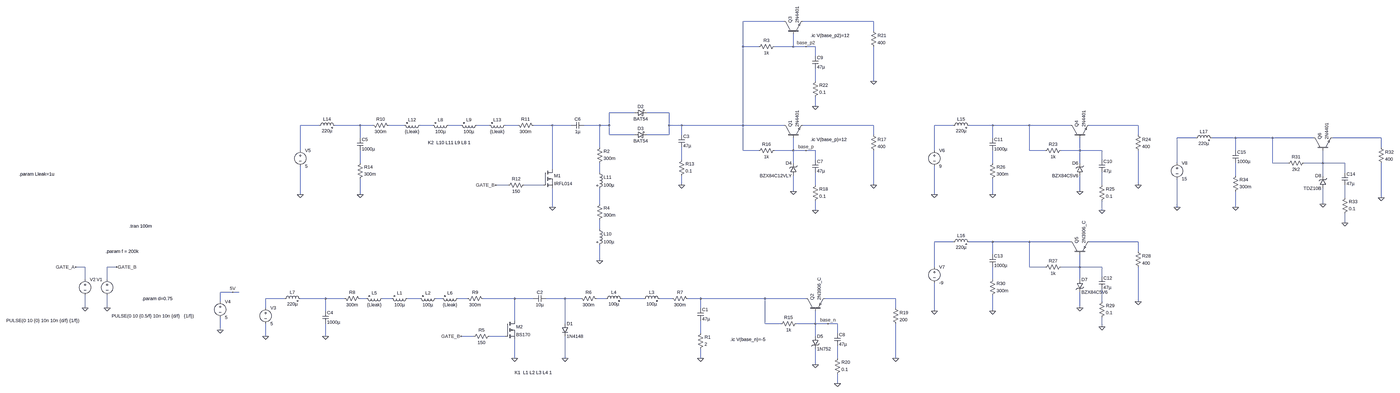
[diagram p0: schematic 101_power_supply.asc, whole sheet]
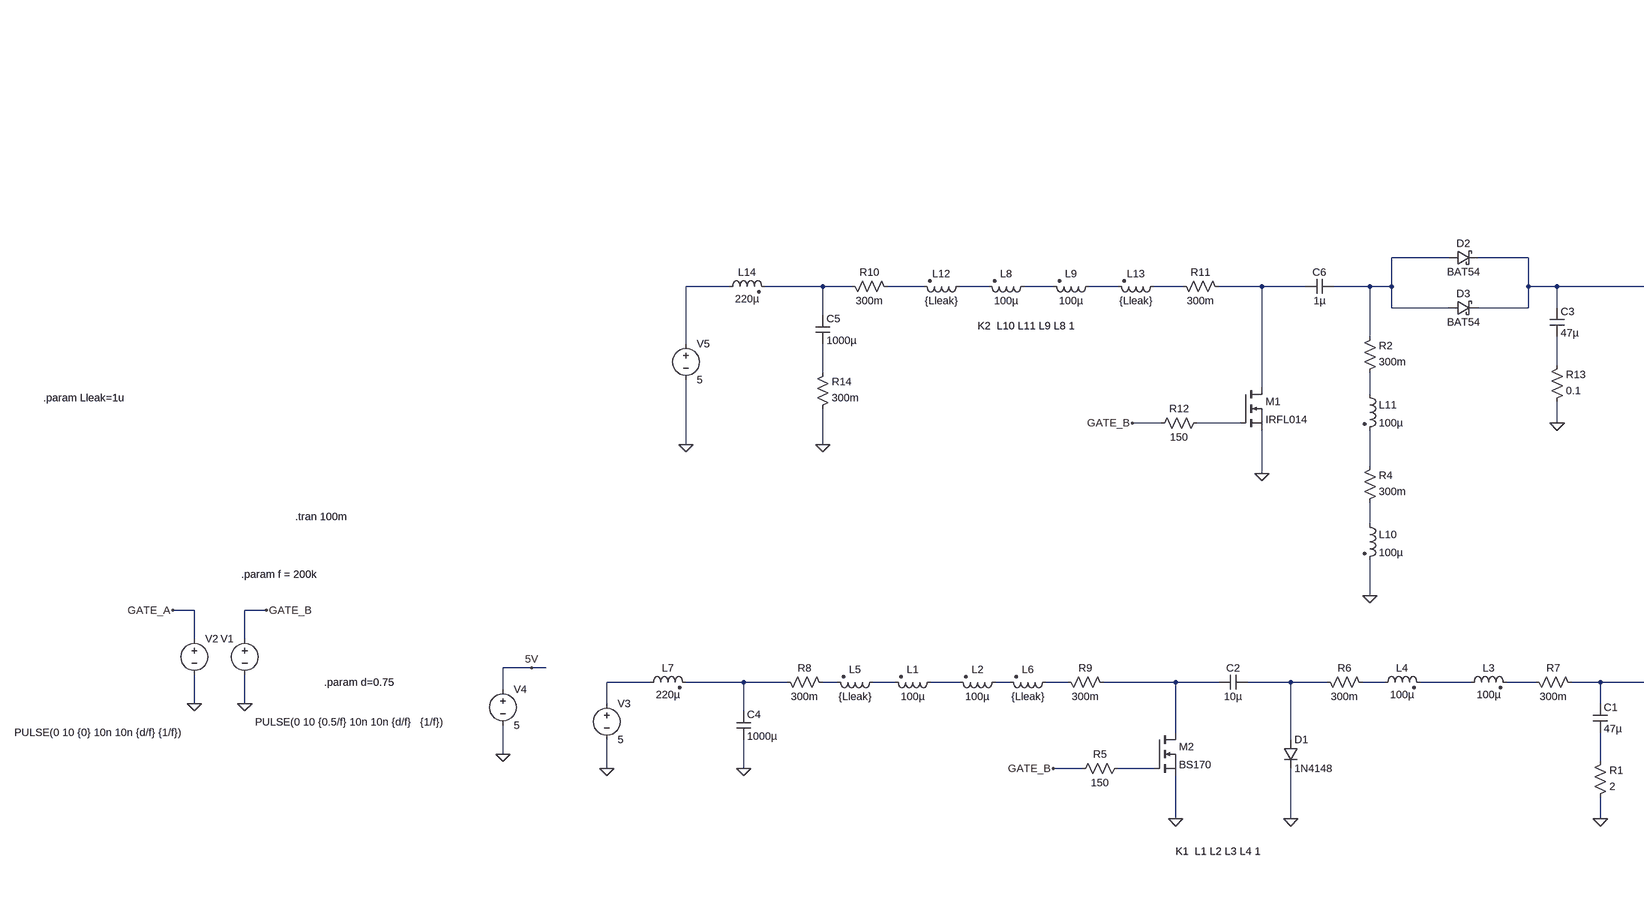
[diagram p1: schematic 101_power_supply.asc, part, row 1 of 1, column 1 of 2]
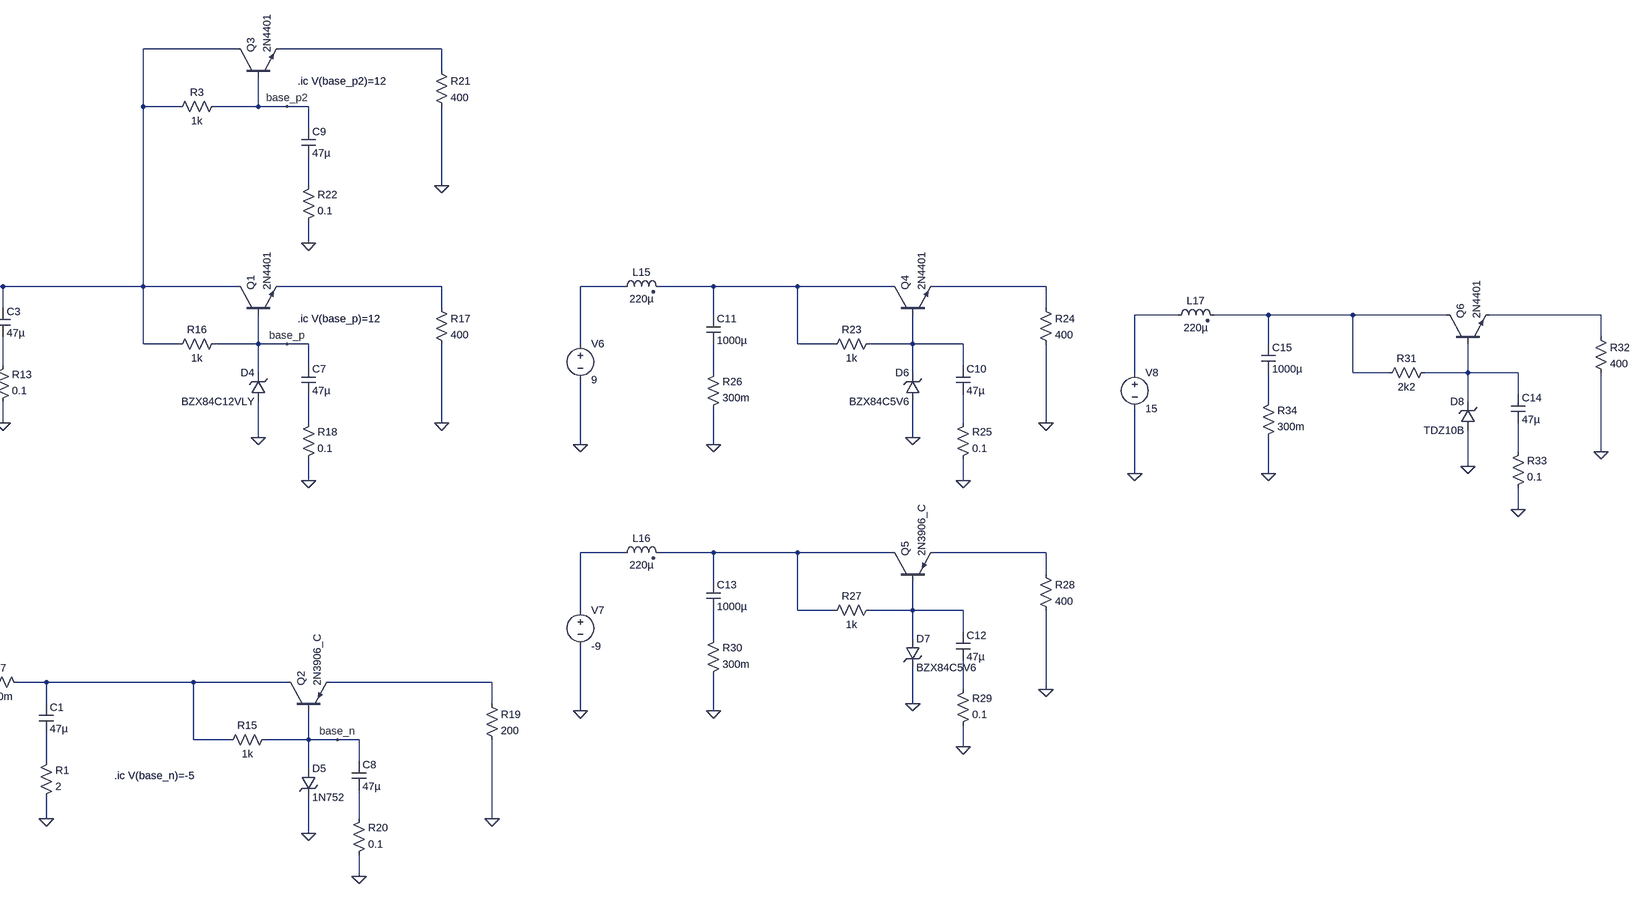
[diagram p2: schematic 101_power_supply.asc, part, row 1 of 1, column 2 of 2]
101_power_supply.asc, the LTspice schematic file:
Version 4
SHEET 1 4996 680
WIRE 1504 -1648 1296 -1648
WIRE 1968 -1648 1600 -1648
WIRE 1968 -1600 1968 -1648
WIRE 1296 -1520 1296 -1648
WIRE 1376 -1520 1296 -1520
WIRE 1552 -1520 1552 -1584
WIRE 1552 -1520 1456 -1520
WIRE 1616 -1520 1552 -1520
WIRE 1664 -1520 1616 -1520
WIRE 1664 -1472 1664 -1520
WIRE 1664 -1344 1664 -1408
WIRE 1968 -1344 1968 -1520
WIRE 1664 -1216 1664 -1264
WIRE 640 -1184 512 -1184
WIRE 816 -1184 704 -1184
WIRE -960 -1120 -1056 -1120
WIRE -752 -1120 -880 -1120
WIRE -688 -1120 -752 -1120
WIRE -528 -1120 -608 -1120
WIRE -384 -1120 -448 -1120
WIRE -240 -1120 -304 -1120
WIRE -96 -1120 -160 -1120
WIRE 48 -1120 -16 -1120
WIRE 224 -1120 128 -1120
WIRE 320 -1120 224 -1120
WIRE 464 -1120 384 -1120
WIRE 512 -1120 512 -1184
WIRE 512 -1120 464 -1120
WIRE 816 -1120 816 -1184
WIRE 880 -1120 816 -1120
WIRE 1296 -1120 1296 -1520
WIRE 1296 -1120 880 -1120
WIRE 1504 -1120 1296 -1120
WIRE 1968 -1120 1600 -1120
WIRE 2464 -1120 2368 -1120
WIRE 2672 -1120 2544 -1120
WIRE 2864 -1120 2672 -1120
WIRE 3072 -1120 2864 -1120
WIRE 3536 -1120 3168 -1120
WIRE 512 -1072 512 -1120
WIRE 640 -1072 512 -1072
WIRE 816 -1072 816 -1120
WIRE 816 -1072 704 -1072
WIRE 880 -1072 880 -1120
WIRE 1968 -1072 1968 -1120
WIRE 3536 -1072 3536 -1120
WIRE -752 -1056 -752 -1120
WIRE 2672 -1056 2672 -1120
WIRE 3856 -1056 3760 -1056
WIRE 4064 -1056 3936 -1056
WIRE 4256 -1056 4064 -1056
WIRE 4464 -1056 4256 -1056
WIRE 4928 -1056 4560 -1056
WIRE 464 -1008 464 -1120
WIRE 4928 -1008 4928 -1056
WIRE -1056 -992 -1056 -1120
WIRE 1296 -992 1296 -1120
WIRE 1376 -992 1296 -992
WIRE 1552 -992 1552 -1056
WIRE 1552 -992 1456 -992
WIRE 1616 -992 1552 -992
WIRE 1664 -992 1616 -992
WIRE 2368 -992 2368 -1120
WIRE 2864 -992 2864 -1120
WIRE 2944 -992 2864 -992
WIRE 3120 -992 3120 -1056
WIRE 3120 -992 3024 -992
WIRE 3232 -992 3120 -992
WIRE 4064 -992 4064 -1056
WIRE 880 -944 880 -1008
WIRE 1664 -944 1664 -992
WIRE 3232 -944 3232 -992
WIRE -752 -928 -752 -992
WIRE 1552 -928 1552 -992
WIRE 2672 -928 2672 -992
WIRE 3120 -928 3120 -992
WIRE 3760 -928 3760 -1056
WIRE 4256 -928 4256 -1056
WIRE 4336 -928 4256 -928
WIRE 4512 -928 4512 -992
WIRE 4512 -928 4416 -928
WIRE 4624 -928 4512 -928
WIRE 224 -896 224 -1120
WIRE 464 -880 464 -928
WIRE 4624 -880 4624 -928
WIRE 4064 -864 4064 -928
WIRE 4512 -864 4512 -928
WIRE 0 -816 -64 -816
WIRE 176 -816 80 -816
WIRE 880 -816 880 -864
WIRE 1664 -816 1664 -880
WIRE 1968 -816 1968 -992
WIRE 3232 -816 3232 -880
WIRE 3536 -816 3536 -992
WIRE 1552 -784 1552 -864
WIRE 3120 -784 3120 -864
WIRE -1056 -768 -1056 -912
WIRE -752 -768 -752 -848
WIRE 2368 -768 2368 -912
WIRE 2672 -768 2672 -848
WIRE 4624 -752 4624 -816
WIRE 4928 -752 4928 -928
WIRE 464 -720 464 -800
WIRE 4512 -720 4512 -800
WIRE 224 -704 224 -800
WIRE 3760 -704 3760 -848
WIRE 4064 -704 4064 -784
WIRE 1664 -688 1664 -736
WIRE 3232 -688 3232 -736
WIRE 4624 -624 4624 -672
WIRE 464 -592 464 -640
WIRE 2464 -528 2368 -528
WIRE 2672 -528 2544 -528
WIRE 2864 -528 2672 -528
WIRE 3072 -528 2864 -528
WIRE 3536 -528 3168 -528
WIRE 3536 -480 3536 -528
WIRE 2672 -464 2672 -528
WIRE 464 -432 464 -512
WIRE -2672 -400 -2720 -400
WIRE -2512 -400 -2560 -400
WIRE 2368 -400 2368 -528
WIRE 2864 -400 2864 -528
WIRE 2944 -400 2864 -400
WIRE 3120 -400 3120 -464
WIRE 3120 -400 3024 -400
WIRE 3232 -400 3120 -400
WIRE 3232 -352 3232 -400
WIRE -2672 -336 -2672 -400
WIRE -2560 -336 -2560 -400
WIRE 2672 -336 2672 -400
WIRE 3120 -336 3120 -400
WIRE -1424 -272 -1488 -272
WIRE -1392 -272 -1424 -272
WIRE -1136 -240 -1232 -240
WIRE -928 -240 -1056 -240
WIRE -832 -240 -928 -240
WIRE -720 -240 -752 -240
WIRE -592 -240 -640 -240
WIRE -448 -240 -512 -240
WIRE -336 -240 -368 -240
WIRE -208 -240 -256 -240
WIRE 32 -240 -128 -240
WIRE 128 -240 32 -240
WIRE 288 -240 192 -240
WIRE 368 -240 288 -240
WIRE 496 -240 448 -240
WIRE 688 -240 576 -240
WIRE 832 -240 768 -240
WIRE 976 -240 912 -240
WIRE 1408 -240 976 -240
WIRE 1616 -240 1408 -240
WIRE 2080 -240 1712 -240
WIRE -1488 -224 -1488 -272
WIRE 3232 -224 3232 -288
WIRE 3536 -224 3536 -400
WIRE -2672 -192 -2672 -256
WIRE -2560 -192 -2560 -256
WIRE -1232 -192 -1232 -240
WIRE 976 -192 976 -240
WIRE 2080 -192 2080 -240
WIRE 3120 -192 3120 -272
WIRE -928 -176 -928 -240
WIRE 2368 -176 2368 -320
WIRE 2672 -176 2672 -256
WIRE 32 -128 32 -240
WIRE 288 -112 288 -240
WIRE 1408 -112 1408 -240
WIRE 1488 -112 1408 -112
WIRE 1664 -112 1664 -176
WIRE 1664 -112 1568 -112
WIRE 1728 -112 1664 -112
WIRE 1776 -112 1728 -112
WIRE 3232 -96 3232 -144
WIRE -1488 -80 -1488 -144
WIRE 976 -64 976 -128
WIRE 1776 -64 1776 -112
WIRE -1232 -48 -1232 -112
WIRE -928 -48 -928 -112
WIRE -176 -48 -240 -48
WIRE -16 -48 -96 -48
WIRE 1664 -48 1664 -112
WIRE 32 64 32 -32
WIRE 288 64 288 -48
WIRE 976 64 976 16
WIRE 1776 64 1776 0
WIRE 2080 64 2080 -112
WIRE 1664 96 1664 16
WIRE 1776 192 1776 144
FLAG -2560 -192 0
FLAG -2512 -400 GATE_B
FLAG -2720 -400 GATE_A
FLAG -1232 -48 0
FLAG -2672 -192 0
FLAG -240 -48 GATE_B
FLAG 32 64 0
FLAG -928 -48 0
FLAG 288 64 0
FLAG 976 64 0
FLAG -1488 -80 0
FLAG -1424 -272 5V
FLAG -1056 -768 0
FLAG -64 -816 GATE_B
FLAG 224 -704 0
FLAG -752 -768 0
FLAG 880 -816 0
FLAG 464 -432 0
FLAG 1552 -784 0
FLAG 1968 -816 0
FLAG 1664 -688 0
FLAG 1616 -992 base_p
FLAG 1664 96 0
FLAG 2080 64 0
FLAG 1776 192 0
FLAG 1728 -112 base_n
FLAG 1968 -1344 0
FLAG 1664 -1216 0
FLAG 1616 -1520 base_p2
FLAG 3120 -784 0
FLAG 3536 -816 0
FLAG 3232 -688 0
FLAG 2368 -768 0
FLAG 2672 -768 0
FLAG 3120 -192 0
FLAG 3536 -224 0
FLAG 3232 -96 0
FLAG 2368 -176 0
FLAG 2672 -176 0
FLAG 4512 -720 0
FLAG 4928 -752 0
FLAG 4624 -624 0
FLAG 3760 -704 0
FLAG 4064 -704 0
SYMBOL voltage -2560 -352 M0
WINDOW 123 0 0 Left 0
WINDOW 39 0 0 Left 0
WINDOW 3 -444 201 Left 2
SYMATTR Value PULSE(0 10 {0.5/f} 10n 10n {d/f}   {1/f})
SYMATTR InstName V1
SYMBOL voltage -2672 -352 R0
WINDOW 123 0 0 Left 0
WINDOW 39 0 0 Left 0
WINDOW 3 -400 224 Left 2
SYMATTR Value PULSE(0 10 {0} 10n 10n {d/f} {1/f})
SYMATTR InstName V2
SYMBOL voltage -1232 -208 R0
WINDOW 123 0 0 Left 0
WINDOW 39 0 0 Left 0
SYMATTR InstName V3
SYMATTR Value 5
SYMBOL cap 960 -192 R0
SYMATTR InstName C1
SYMATTR Value 47µ
SYMBOL ind2 -496 -256 R90
WINDOW 0 4 56 VBottom 2
WINDOW 3 32 56 VTop 2
SYMATTR InstName L1
SYMATTR Value 100µ
SYMATTR Type ind
SYMATTR SpiceLine Rser=0.2
SYMBOL ind2 -352 -256 R90
WINDOW 0 4 56 VBottom 2
WINDOW 3 32 56 VTop 2
SYMATTR InstName L2
SYMATTR Value 100µ
SYMATTR Type ind
SYMATTR SpiceLine Rser=0.2
SYMBOL ind2 672 -224 R270
WINDOW 0 32 56 VTop 2
WINDOW 3 4 56 VBottom 2
SYMATTR InstName L3
SYMATTR Value 100µ
SYMATTR Type ind
SYMATTR SpiceLine Rser=0.4
SYMBOL ind2 480 -224 R270
WINDOW 0 32 56 VTop 2
WINDOW 3 4 56 VBottom 2
SYMATTR InstName L4
SYMATTR Value 100µ
SYMATTR Type ind
SYMATTR SpiceLine Rser=0.4
SYMBOL res 464 -224 M270
WINDOW 0 32 56 VTop 2
WINDOW 3 0 56 VBottom 2
SYMATTR InstName R6
SYMATTR Value 300m
SYMBOL res 928 -224 M270
WINDOW 0 32 56 VTop 2
WINDOW 3 0 56 VBottom 2
SYMATTR InstName R7
SYMATTR Value 300m
SYMBOL res -848 -256 M90
WINDOW 0 0 56 VBottom 2
WINDOW 3 32 56 VTop 2
SYMATTR InstName R8
SYMATTR Value 300m
SYMBOL res -224 -256 M90
WINDOW 0 0 56 VBottom 2
WINDOW 3 32 56 VTop 2
SYMATTR InstName R9
SYMATTR Value 300m
SYMBOL res -80 -64 R90
WINDOW 0 0 56 VBottom 2
WINDOW 3 32 56 VTop 2
SYMATTR InstName R5
SYMATTR Value 150
SYMBOL nmos -16 -128 R0
SYMATTR InstName M2
SYMATTR Value BS170
SYMBOL ind2 -624 -256 R90
WINDOW 0 4 56 VBottom 2
WINDOW 3 32 56 VTop 2
SYMATTR InstName L5
SYMATTR Value {Lleak}
SYMATTR Type ind
SYMATTR SpiceLine Rser=0.2
SYMBOL ind2 -240 -256 R90
WINDOW 0 4 56 VBottom 2
WINDOW 3 32 56 VTop 2
SYMATTR InstName L6
SYMATTR Value {Lleak}
SYMATTR Type ind
SYMATTR SpiceLine Rser=0.2
SYMBOL ind2 -1152 -224 R270
WINDOW 0 32 56 VTop 2
WINDOW 3 4 56 VBottom 2
SYMATTR InstName L7
SYMATTR Value 220µ
SYMATTR Type ind
SYMATTR SpiceLine Rser=0.2
SYMBOL cap -944 -176 R0
SYMATTR InstName C4
SYMATTR Value 1000µ
SYMBOL cap 192 -256 R90
WINDOW 0 0 32 VBottom 2
WINDOW 3 32 32 VTop 2
SYMATTR InstName C2
SYMATTR Value 10µ
SYMBOL diode 272 -112 R0
SYMATTR InstName D1
SYMATTR Value 1N4148
SYMBOL res 960 32 M180
WINDOW 0 36 76 Left 2
WINDOW 3 36 40 Left 2
SYMATTR InstName R1
SYMATTR Value 2
SYMBOL voltage -1488 -240 R0
WINDOW 123 0 0 Left 0
WINDOW 39 0 0 Left 0
SYMATTR InstName V4
SYMATTR Value 5
SYMBOL voltage -1056 -1008 R0
WINDOW 123 0 0 Left 0
WINDOW 39 0 0 Left 0
SYMATTR InstName V5
SYMATTR Value 5
SYMBOL cap 864 -1072 R0
SYMATTR InstName C3
SYMATTR Value 47µ
SYMBOL ind2 -288 -1136 R90
WINDOW 0 4 56 VBottom 2
WINDOW 3 32 56 VTop 2
SYMATTR InstName L8
SYMATTR Value 100µ
SYMATTR Type ind
SYMATTR SpiceLine Rser=0.2
SYMBOL ind2 -144 -1136 R90
WINDOW 0 4 56 VBottom 2
WINDOW 3 32 56 VTop 2
SYMATTR InstName L9
SYMATTR Value 100µ
SYMATTR Type ind
SYMATTR SpiceLine Rser=0.2
SYMBOL ind2 448 -608 R0
SYMATTR InstName L10
SYMATTR Value 100µ
SYMATTR Type ind
SYMATTR SpiceLine Rser=0.4
SYMBOL ind2 448 -896 R0
SYMATTR InstName L11
SYMATTR Value 100µ
SYMATTR Type ind
SYMATTR SpiceLine Rser=0.4
SYMBOL res 448 -912 M180
WINDOW 0 36 76 Left 2
WINDOW 3 36 40 Left 2
SYMATTR InstName R2
SYMATTR Value 300m
SYMBOL res 448 -624 M180
WINDOW 0 36 76 Left 2
WINDOW 3 36 40 Left 2
SYMATTR InstName R4
SYMATTR Value 300m
SYMBOL res -704 -1136 M90
WINDOW 0 0 56 VBottom 2
WINDOW 3 32 56 VTop 2
SYMATTR InstName R10
SYMATTR Value 300m
SYMBOL res 32 -1136 M90
WINDOW 0 0 56 VBottom 2
WINDOW 3 32 56 VTop 2
SYMATTR InstName R11
SYMATTR Value 300m
SYMBOL res 96 -832 R90
WINDOW 0 0 56 VBottom 2
WINDOW 3 32 56 VTop 2
SYMATTR InstName R12
SYMATTR Value 150
SYMBOL ind2 -432 -1136 R90
WINDOW 0 4 56 VBottom 2
WINDOW 3 32 56 VTop 2
SYMATTR InstName L12
SYMATTR Value {Lleak}
SYMATTR Type ind
SYMATTR SpiceLine Rser=0.2
SYMBOL ind2 0 -1136 R90
WINDOW 0 4 56 VBottom 2
WINDOW 3 32 56 VTop 2
SYMATTR InstName L13
SYMATTR Value {Lleak}
SYMATTR Type ind
SYMATTR SpiceLine Rser=0.2
SYMBOL ind2 -976 -1104 R270
WINDOW 0 32 56 VTop 2
WINDOW 3 4 56 VBottom 2
SYMATTR InstName L14
SYMATTR Value 220µ
SYMATTR Type ind
SYMATTR SpiceLine Rser=0.2
SYMBOL cap -768 -1056 R0
SYMATTR InstName C5
SYMATTR Value 1000µ
SYMBOL cap 384 -1136 R90
WINDOW 0 0 32 VBottom 2
WINDOW 3 32 32 VTop 2
SYMATTR InstName C6
SYMATTR Value 1µ
SYMBOL schottky 640 -1168 R270
WINDOW 0 32 32 VTop 2
WINDOW 3 0 32 VBottom 2
SYMATTR InstName D2
SYMATTR Value BAT54
SYMATTR Description Diode
SYMATTR Type diode
SYMBOL res 864 -848 M180
WINDOW 0 36 76 Left 2
WINDOW 3 36 40 Left 2
SYMATTR InstName R13
SYMATTR Value 0.1
SYMBOL nmos 176 -896 R0
SYMATTR InstName M1
SYMATTR Value IRFL014
SYMBOL schottky 640 -1056 R270
WINDOW 0 32 32 VTop 2
WINDOW 3 0 32 VBottom 2
SYMATTR InstName D3
SYMATTR Value BAT54
SYMATTR Description Diode
SYMATTR Type diode
SYMBOL res -768 -832 M180
WINDOW 0 36 76 Left 2
WINDOW 3 36 40 Left 2
SYMATTR InstName R14
SYMATTR Value 300m
SYMBOL npn 1504 -1056 R270
SYMATTR InstName Q1
SYMATTR Value 2N4401
SYMBOL res 1472 -1008 R90
WINDOW 0 0 56 VBottom 2
WINDOW 3 32 56 VTop 2
SYMATTR InstName R16
SYMATTR Value 1k
SYMBOL zener 1568 -864 R180
WINDOW 0 24 64 Left 2
WINDOW 3 24 0 Left 2
SYMATTR InstName D4
SYMATTR Value BZX84C12VLY
SYMATTR Description Diode
SYMATTR Type diode
SYMBOL res 1952 -1088 R0
SYMATTR InstName R17
SYMATTR Value 400
SYMBOL cap 1648 -944 R0
SYMATTR InstName C7
SYMATTR Value 47µ
SYMBOL res 1648 -720 M180
WINDOW 0 36 76 Left 2
WINDOW 3 36 40 Left 2
SYMATTR InstName R18
SYMATTR Value 0.1
SYMBOL res 1584 -128 R90
WINDOW 0 0 56 VBottom 2
WINDOW 3 32 56 VTop 2
SYMATTR InstName R15
SYMATTR Value 1k
SYMBOL zener 1648 -48 R0
SYMATTR InstName D5
SYMATTR Value 1N752
SYMATTR Description Diode
SYMATTR Type diode
SYMBOL res 2064 -208 R0
SYMATTR InstName R19
SYMATTR Value 200
SYMBOL cap 1760 -64 R0
SYMATTR InstName C8
SYMATTR Value 47µ
SYMBOL res 1760 160 M180
WINDOW 0 36 76 Left 2
WINDOW 3 36 40 Left 2
SYMATTR InstName R20
SYMATTR Value 0.1
SYMBOL pnp 1616 -176 R270
SYMATTR InstName Q2
SYMATTR Value 2N3906_C
SYMBOL npn 1504 -1584 R270
SYMATTR InstName Q3
SYMATTR Value 2N4401
SYMBOL res 1472 -1536 R90
WINDOW 0 0 56 VBottom 2
WINDOW 3 32 56 VTop 2
SYMATTR InstName R3
SYMATTR Value 1k
SYMBOL res 1952 -1616 R0
SYMATTR InstName R21
SYMATTR Value 400
SYMBOL cap 1648 -1472 R0
SYMATTR InstName C9
SYMATTR Value 47µ
SYMBOL res 1648 -1248 M180
WINDOW 0 36 76 Left 2
WINDOW 3 36 40 Left 2
SYMATTR InstName R22
SYMATTR Value 0.1
SYMBOL npn 3072 -1056 R270
SYMATTR InstName Q4
SYMATTR Value 2N4401
SYMBOL res 3040 -1008 R90
WINDOW 0 0 56 VBottom 2
WINDOW 3 32 56 VTop 2
SYMATTR InstName R23
SYMATTR Value 1k
SYMBOL zener 3136 -864 R180
WINDOW 0 24 64 Left 2
WINDOW 3 24 0 Left 2
SYMATTR InstName D6
SYMATTR Value BZX84C5V6
SYMATTR Description Diode
SYMATTR Type diode
SYMBOL res 3520 -1088 R0
SYMATTR InstName R24
SYMATTR Value 400
SYMBOL cap 3216 -944 R0
SYMATTR InstName C10
SYMATTR Value 47µ
SYMBOL res 3216 -720 M180
WINDOW 0 36 76 Left 2
WINDOW 3 36 40 Left 2
SYMATTR InstName R25
SYMATTR Value 0.1
SYMBOL voltage 2368 -1008 R0
WINDOW 123 0 0 Left 0
WINDOW 39 0 0 Left 0
SYMATTR InstName V6
SYMATTR Value 9
SYMBOL ind2 2448 -1104 R270
WINDOW 0 32 56 VTop 2
WINDOW 3 4 56 VBottom 2
SYMATTR InstName L15
SYMATTR Value 220µ
SYMATTR Type ind
SYMATTR SpiceLine Rser=0.2
SYMBOL cap 2656 -1056 R0
SYMATTR InstName C11
SYMATTR Value 1000µ
SYMBOL res 2656 -832 M180
WINDOW 0 36 76 Left 2
WINDOW 3 36 40 Left 2
SYMATTR InstName R26
SYMATTR Value 300m
SYMBOL res 3040 -416 R90
WINDOW 0 0 56 VBottom 2
WINDOW 3 32 56 VTop 2
SYMATTR InstName R27
SYMATTR Value 1k
SYMBOL zener 3104 -336 R0
SYMATTR InstName D7
SYMATTR Value BZX84C5V6
SYMATTR Description Diode
SYMATTR Type diode
SYMBOL res 3520 -496 R0
SYMATTR InstName R28
SYMATTR Value 400
SYMBOL cap 3216 -352 R0
SYMATTR InstName C12
SYMATTR Value 47µ
SYMBOL res 3216 -128 M180
WINDOW 0 36 76 Left 2
WINDOW 3 36 40 Left 2
SYMATTR InstName R29
SYMATTR Value 0.1
SYMBOL voltage 2368 -416 R0
WINDOW 123 0 0 Left 0
WINDOW 39 0 0 Left 0
SYMATTR InstName V7
SYMATTR Value -9
SYMBOL ind2 2448 -512 R270
WINDOW 0 32 56 VTop 2
WINDOW 3 4 56 VBottom 2
SYMATTR InstName L16
SYMATTR Value 220µ
SYMATTR Type ind
SYMATTR SpiceLine Rser=0.2
SYMBOL cap 2656 -464 R0
SYMATTR InstName C13
SYMATTR Value 1000µ
SYMBOL res 2656 -240 M180
WINDOW 0 36 76 Left 2
WINDOW 3 36 40 Left 2
SYMATTR InstName R30
SYMATTR Value 300m
SYMBOL pnp 3072 -464 R270
SYMATTR InstName Q5
SYMATTR Value 2N3906_C
SYMBOL npn 4464 -992 R270
SYMATTR InstName Q6
SYMATTR Value 2N4401
SYMBOL res 4432 -944 R90
WINDOW 0 0 56 VBottom 2
WINDOW 3 32 56 VTop 2
SYMATTR InstName R31
SYMATTR Value 2k2
SYMBOL zener 4528 -800 R180
WINDOW 0 24 64 Left 2
WINDOW 3 24 0 Left 2
SYMATTR InstName D8
SYMATTR Value TDZ10B
SYMATTR Description Diode
SYMATTR Type diode
SYMBOL res 4912 -1024 R0
SYMATTR InstName R32
SYMATTR Value 400
SYMBOL cap 4608 -880 R0
SYMATTR InstName C14
SYMATTR Value 47µ
SYMBOL res 4608 -656 M180
WINDOW 0 36 76 Left 2
WINDOW 3 36 40 Left 2
SYMATTR InstName R33
SYMATTR Value 0.1
SYMBOL voltage 3760 -944 R0
WINDOW 123 0 0 Left 0
WINDOW 39 0 0 Left 0
SYMATTR InstName V8
SYMATTR Value 15
SYMBOL ind2 3840 -1040 R270
WINDOW 0 32 56 VTop 2
WINDOW 3 4 56 VBottom 2
SYMATTR InstName L17
SYMATTR Value 220µ
SYMATTR Type ind
SYMATTR SpiceLine Rser=0.2
SYMBOL cap 4048 -992 R0
SYMATTR InstName C15
SYMATTR Value 1000µ
SYMBOL res 4048 -768 M180
WINDOW 0 36 76 Left 2
WINDOW 3 36 40 Left 2
SYMATTR InstName R34
SYMATTR Value 300m
TEXT -2448 -608 Left 2 !.tran 100m
TEXT 32 136 Left 2 !K1  L1 L2 L3 L4 1
TEXT -2568 -480 Left 2 !.param f = 200k
TEXT -3008 -872 Left 2 !.param Lleak=1u
TEXT -2384 -240 Left 2 !.param d=0.75
TEXT -408 -1032 Left 2 !K2  L10 L11 L9 L8 1
TEXT 1640 -1048 Left 2 !.ic V(base_p)=12
TEXT 1232 -32 Left 2 !.ic V(base_n)=-5
TEXT 1640 -1576 Left 2 !.ic V(base_p2)=12

The netlist it stands for:
* 101_power_supply.asc
V1 GATE_B 0 PULSE(0 10 {0.5/f} 10n 10n {d/f}   {1/f})
V2 GATE_A 0 PULSE(0 10 {0} 10n 10n {d/f} {1/f})
V3 N038 0 5
C1 N050 N053 47µ
L1 N042 N041 100µ Rser=0.2
L2 N043 N042 100µ Rser=0.2
L3 N048 N049 100µ Rser=0.4
L4 N047 N048 100µ Rser=0.4
R6 N047 N046 300m
R7 N050 N049 300m
R8 N039 N040 300m
R9 N044 N045 300m
R5 N054 GATE_B 150
M2 N045 N054 0 0 BS170
L5 N041 N040 {Lleak} Rser=0.2
L6 N044 N043 {Lleak} Rser=0.2
L7 N038 N039 220µ Rser=0.2
C4 N039 0 1000µ
C2 N046 N045 10µ
D1 N046 0 1N4148
R1 0 N053 2
V4 5V 0 5
V5 N005 0 5
C3 N001 N021 47µ
L8 N009 N008 100µ Rser=0.2
L9 N010 N009 100µ Rser=0.2
L10 N032 0 100µ Rser=0.4
L11 N025 N031 100µ Rser=0.4
R2 N025 N004 300m
R4 N032 N031 300m
R10 N006 N007 300m
R11 N011 N012 300m
R12 N027 GATE_B 150
L12 N008 N007 {Lleak} Rser=0.2
L13 N011 N010 {Lleak} Rser=0.2
L14 N005 N006 220µ Rser=0.2
C5 N006 N022 1000µ
C6 N004 N012 1µ
D2 N004 N001 BAT54
R13 0 N021 0.1
M1 N012 N027 0 0 IRFL014
D3 N004 N001 BAT54
R14 0 N022 300m
Q1 N001 base_p N013 0 2N4401
R16 base_p N001 1k
D4 0 base_p BZX84C12VLY
R17 N013 0 400
C7 base_p N028 47µ
R18 0 N028 0.1
R15 base_n N050 1k
D5 base_n 0 1N752
R19 N051 0 200
C8 base_n N055 47µ
R20 0 N055 0.1
Q2 N050 base_n N051 0 2N3906_C
Q3 N001 base_p2 N002 0 2N4401
R3 base_p2 N001 1k
R21 N002 0 400
C9 base_p2 N003 47µ
R22 0 N003 0.1
Q4 N015 N020 N016 0 2N4401
R23 N020 N015 1k
D6 0 N020 BZX84C5V6
R24 N016 0 400
C10 N020 N029 47µ
R25 0 N029 0.1
V6 N014 0 9
L15 N014 N015 220µ Rser=0.2
C11 N015 N023 1000µ
R26 0 N023 300m
R27 N036 N034 1k
D7 N036 0 BZX84C5V6
R28 N035 0 400
C12 N036 N052 47µ
R29 0 N052 0.1
V7 N033 0 -9
L16 N033 N034 220µ Rser=0.2
C13 N034 N037 1000µ
R30 0 N037 300m
Q5 N034 N036 N035 0 2N3906_C
Q6 N018 N024 N019 0 2N4401
R31 N024 N018 2k2
D8 0 N024 TDZ10B
R32 N019 0 400
C14 N024 N030 47µ
R33 0 N030 0.1
V8 N017 0 15
L17 N017 N018 220µ Rser=0.2
C15 N018 N026 1000µ
R34 0 N026 300m
.model D D
.lib standard.dio
.model NPN NPN
.model PNP PNP
.lib standard.bjt
.model NMOS NMOS
.model PMOS PMOS
.lib standard.mos
.tran 100m
K1  L1 L2 L3 L4 1
.param f = 200k
.param Lleak=1u
.param d=0.75
K2  L10 L11 L9 L8 1
.ic V(base_p)=12
.ic V(base_n)=-5
.ic V(base_p2)=12
.backanno
.end